# Altium schematic sheet Control Levitador.SchDoc
size A3
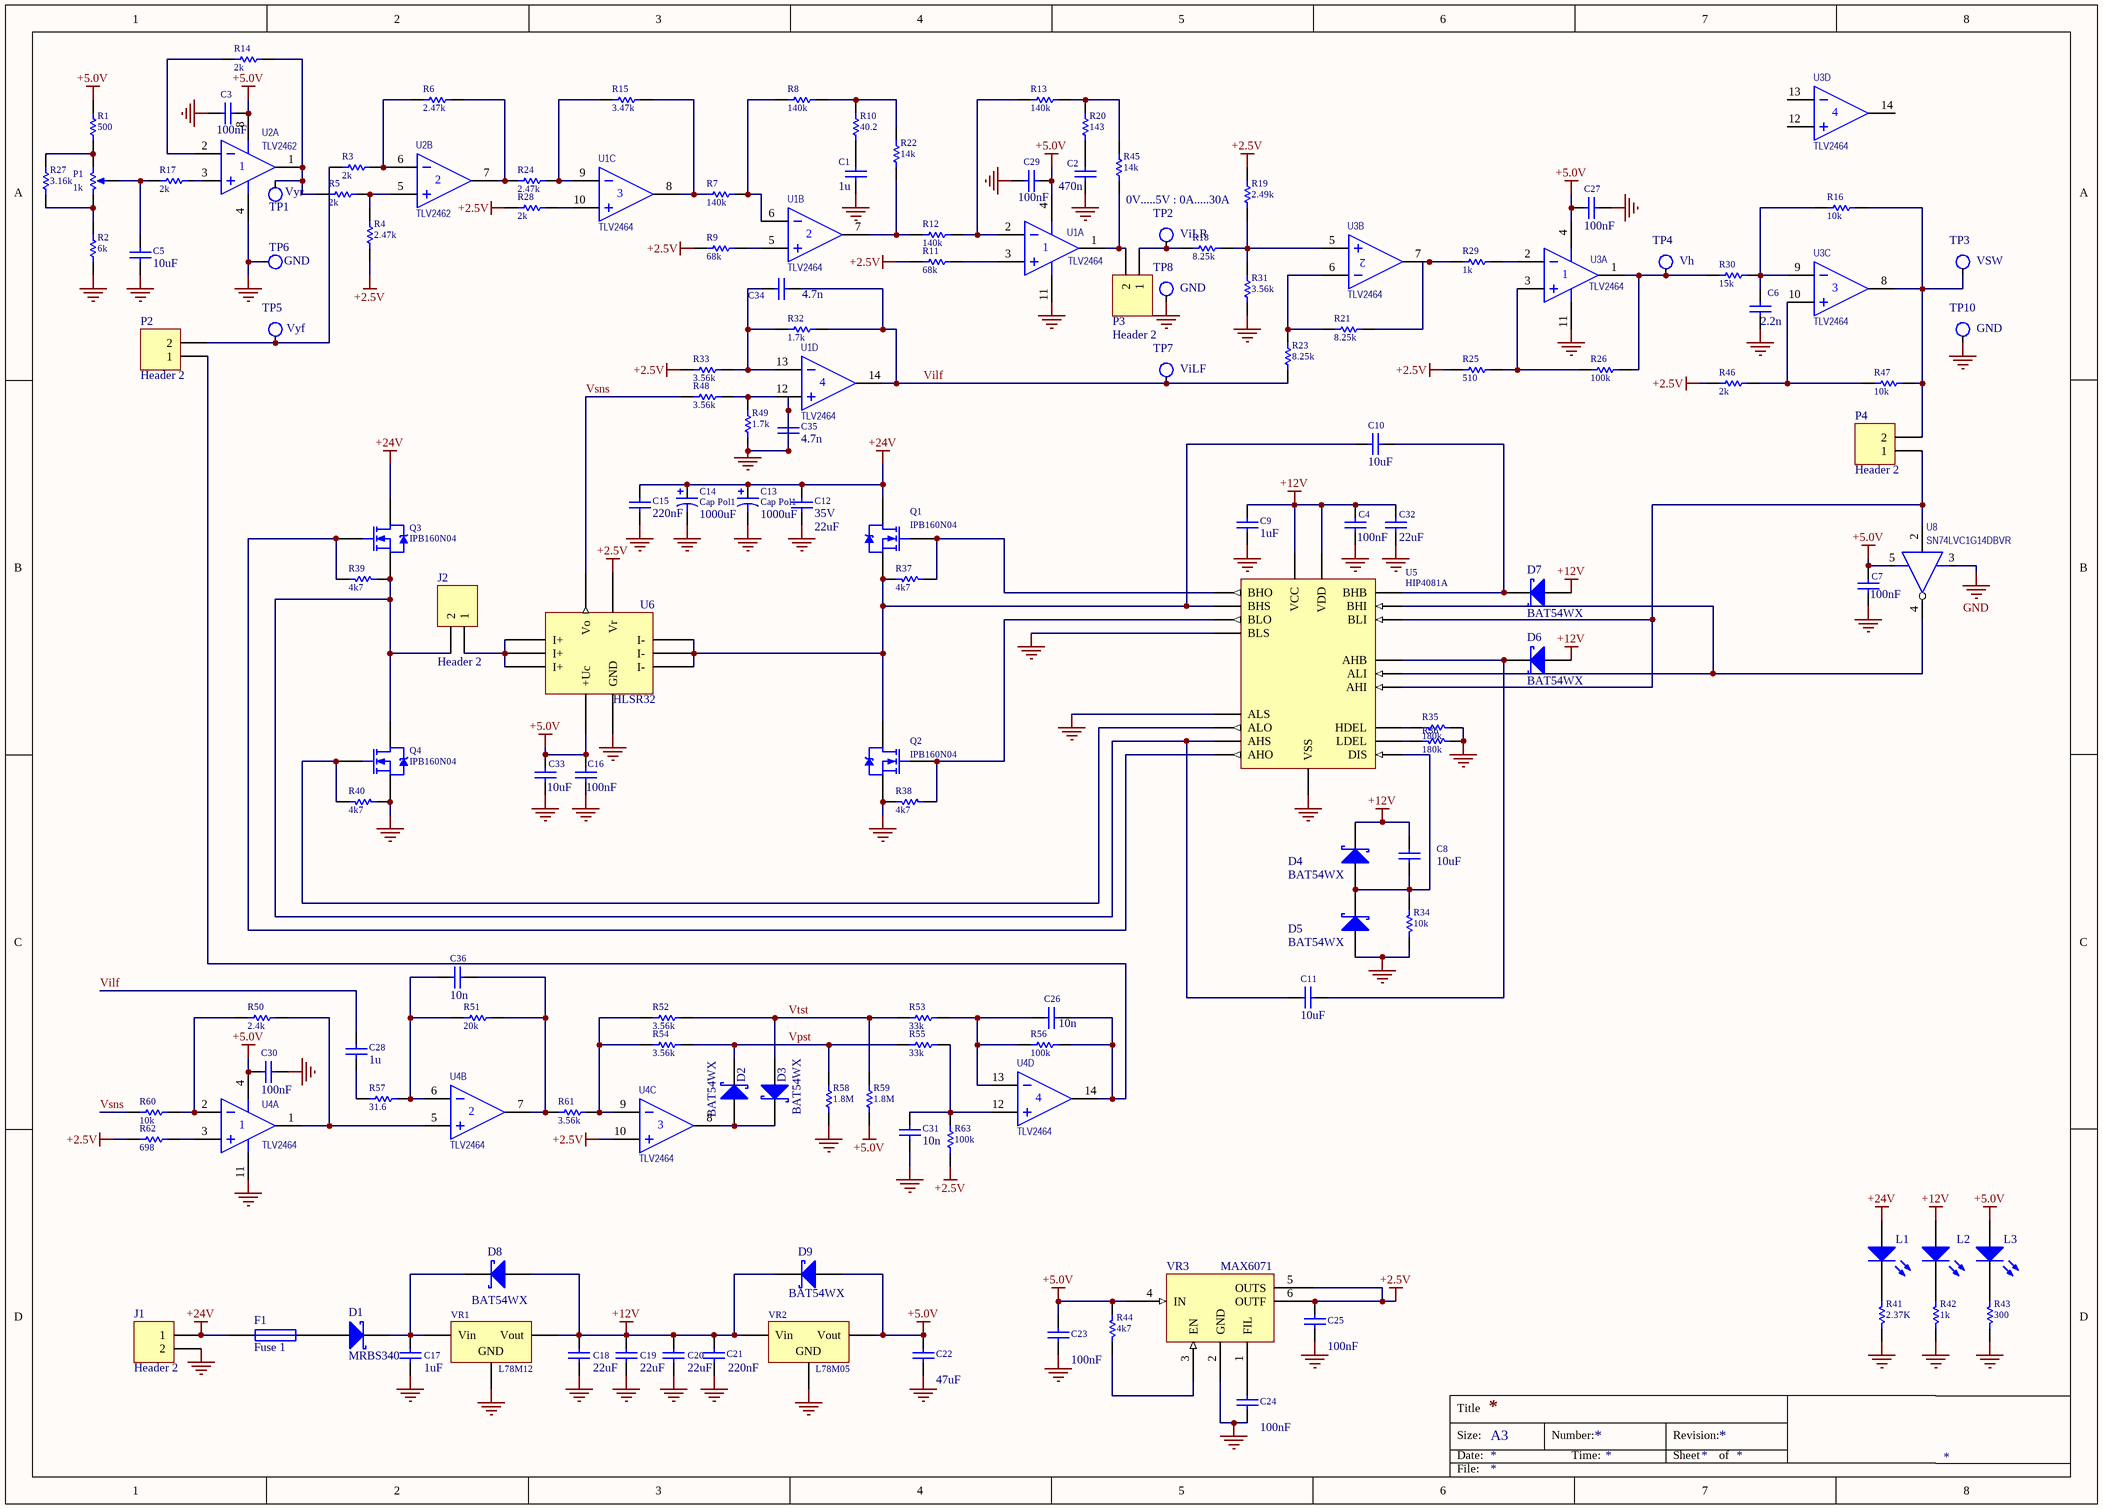
[diagram p0: Control Levitador.SchDoc]

## Parts
C1  1u  [C1206]
C2  470n  [C1206]
C3  100nF  [C1206]
C4  100nF  [C1206]
C5  10uF  [C1206]
C6  2.2n  [C1206]
C7  100nF  [C1206]
C8  10uF  [C1206]
C9  1uF  [C1206]
C10  10uF  [C1206]
C11  10uF  [C1206]
C12  Voltage: 35V  [C0805]  (hidden comment: 22uF)
C13  Cap Pol1  value 1000uF  [ALU CASE P]
C14  Cap Pol1  value 1000uF  [ALU CASE P]
C15  220nF  [C1206]
C16  100nF  [C1206]
C17  1uF  [C1206]
C18  22uF  [C1206]
C19  22uF  [C1206]
C20  22uF  [C1206]
C21  220nF  [C1206]
C22  47uF  [C1206]
C23  100nF  [C1206]
C24  100nF  [C1206]
C25  100nF  [C1206]
C26  10n  [C1206]
C27  100nF  [C1206]
C28  1u  [C1206]
C29  100nF  [C1206]
C30  100nF  [C1206]
C31  10n  [C1206]
C32  22uF  [C1206]
C33  10uF  [C1206]
C34  4.7n  [C1206]
C35  4.7n  [C1206]
C36  10n  [C1206]
D1  MRBS340  [DO214AB]
D2  BAT54WX  [SOD523]
D3  BAT54WX  [SOD523]
D4  BAT54WX  [SOD523]
D5  BAT54WX  [SOD523]
D6  BAT54WX  [SOD523]
D7  BAT54WX  [SOD523]
D8  BAT54WX  [SOD523]
D9  BAT54WX  [SOD523]
F1  Fuse 1  [R1206]
J1  Header 2  [SMKDS5-2-9.5]
J2  Header 2  [SMKDS5-2-9.5]
L1  LED1  [LED 1206 RED]  (value not drawn)
L2  LED1  [LED 1206 RED]  (value not drawn)
L3  LED1  [LED 1206 RED]  (value not drawn)
P1  value 1k  [BOR3]  (hidden comment: RPot)
P2  Header 2  [HDR1X2]
P3  Header 2  [HDR1X2]
P4  Header 2  [HDR1X2]
Q1  IPB160N04  [TO263-7S]
Q2  IPB160N04  [TO263-7S]
Q3  IPB160N04  [TO263-7S]
Q4  IPB160N04  [TO263-7S]
R1  500  [R1206]
R2  6k  [R1206]
R3  2k  [R1206]
R4  2.47k  [R1206]
R5  2k  [R1206]
R6  2.47k  [R1206]
R7  140k  [R1206]
R8  140k  [R1206]
R9  68k  [R1206]
R10  40.2  [R1206]
R11  68k  [R1206]
R12  140k  [R1206]
R13  140k  [R1206]
R14  2k  [R1206]
R15  3.47k  [R1206]
R16  10k  [R1206]
R17  2k  [R1206]
R18  8.25k  [R1206]
R19  2.49k  [R1206]
R20  143  [R1206]
R21  8.25k  [R1206]
R22  14k  [R1206]
R23  8.25k  [R1206]
R24  2.47k  [R1206]
R25  510  [R1206]
R26  100k  [R1206]
R27  3.16k  [R1206]
R28  2k  [R1206]
R29  1k  [R1206]
R30  15k  [R1206]
R31  3.56k  [R1206]
R32  1.7k  [R1206]
R33  3.56k  [R1206]
R34  10k  [R1206]
R35  180k  [R1206]
R36  180k  [R1206]
R37  4k7  [R1206]
R38  4k7  [R1206]
R39  4k7  [R1206]
R40  4k7  [R1206]
R41  2.37K  [R1206]
R42  1k  [R1206]
R43  300  [R1206]
R44  4k7  [R1206]
R45  14k  [R1206]
R46  2k  [R1206]
R47  10k  [R1206]
R48  3.56k  [R1206]
R49  1.7k  [R1206]
R50  2.4k  [R1206]
R51  20k  [R1206]
R52  3.56k  [R1206]
R53  33k  [R1206]
R54  3.56k  [R1206]
R55  33k  [R1206]
R56  100k  [R1206]
R57  31.6  [R1206]
R58  1.8M  [R1206]
R59  1.8M  [R1206]
R60  10k  [R1206]
R61  3.56k  [R1206]
R62  698  [R1206]
R63  100k  [R1206]
TP1  Vyr  [TestPoint Keystone 5000 Silver-Red]
TP2  ViLR  [TestPoint Keystone 5000 Silver-Red]
TP3  VSW  [TestPoint Keystone 5000 Silver-Red]
TP4  Vh  [TestPoint Keystone 5000 Silver-Red]
TP5  Vyf  [TestPoint Keystone 5000 Silver-Red]
TP6  GND  [TestPoint Keystone 5000 Silver-Red]
TP7  ViLF  [TestPoint Keystone 5000 Silver-Red]
TP8  GND  [TestPoint Keystone 5000 Silver-Red]
TP10  GND  [TestPoint Keystone 5000 Silver-Red]
U1  TLV2464  [SOIC14]  (parts A,B,C,D of 4)
U2  TLV2462  [SOIC8]  (parts A,B of 2)
U3  TLV2464  [SOIC14]  (parts A,B,C,D of 4)
U4  TLV2464  [SOIC14]  (parts A,B,C,D of 4)
U5  HIP4081A  [SOIC20]
U6  HLSR32  [HSLR-P]
U8  SN74LVC1G14DBVR  [SOT23-5]
VR1  L78M12  [TO252-AA]
VR2  L78M05  [TO252-AA]
VR3  MAX6071  [SOT23-6]

## Nets
+2.5V: C25.2 R4.1 R9.1 R11.2 R19.2 R25.2 R28.1 R33.1 R46.2 R62.1 R63.2 U4.10(IN+) U6.1(Vr) VR3.5(OUTS) VR3.6(OUTF)
+5.0V: C3.2 C7.2 C16.2 C22.2 C23.2 C27.2 C29.2 C30.2 C33.2 D9.1(A) L3.1(A) R1.2 R44.2 R59.1 U1.4(V+) U2.8(V+) U3.4(V+) U4.4(V+) U6.4(+Uc) U8.5(V+) VR2.3(Vout) VR3.4(IN)
+12V: C4.2 C8.1 C9.2 C18.2 C19.2 C20.2 C21.2 C32.2 D4.2(K) D6.1(A) D7.1(A) D8.1(A) D9.2(K) L2.1(A) U5.15(VCC) U5.16(VDD) VR1.3(Vout) VR2.1(Vin)
+24V: C12.2 C13.1 C14.1 C15.2 F1.1 J1.1 L1.1(A) Q1.4(D) Q3.4(D)
GND: C1.1 C2.1 C3.1 C4.1 C5.1 C6.1 C7.1 C9.1 C12.1 C13.2 C14.2 C15.1 C16.1 C17.1 C18.1 C19.1 C20.1 C21.1 C22.1 C23.1 C24.1 C25.1 C27.1 C29.1 C30.1 C31.1 C32.1 C33.1 C35.1 C35.2 D5.1(A) J1.2 Q2.2(S) Q2.3(S) Q2.5(S) Q2.6(S) Q2.7(S) Q4.2(S) Q4.3(S) Q4.5(S) Q4.6(S) Q4.7(S) R2.1 R31.1 R34.2 R35.1 R36.1 R38.2 R40.1 R41.1 R42.2 R43.1 R49.1 R58.1 TP6.1 TP8.1 TP10.1 U1.11(V-) U2.4(V-) U3.11(V-) U4.11(V-) U5.4(VSS) U5.14(ALS) U5.17(BLS) U6.3(GND) U8.3(V-) VR1.4(GND) VR2.4(GND) VR3.2(GND)
Vilf: C28.1 C34.2 R23.1 R32.2 TP7.1 U1.14(OUT)
Vpst: D2.2(K) R54.2 R55.2 R58.2
Vsns: R48.2 R60.1 U6.2(Vo)
Vtst: D3.1(A) R52.2 R53.2 R59.2
NetC1_2: C1.2 R10.1
NetC2_2: C2.2 R20.1
NetC5_2: C5.2 P1.2(TAP) R17.2
NetC6_2: C6.2 R16.1 R30.2 U3.9(IN-)
NetC8_2: C8.2 D4.1(A) D5.2(K) R34.1 U5.3(DIS)
NetC10_1: C10.1 D7.2(K) U5.1(BHB)
NetC10_2: C10.2 Q1.2(S) Q1.3(S) Q1.5(S) Q1.6(S) Q1.7(S) Q2.4(D) R37.2 U5.19(BHS) U6.5(I-) U6.6(I-) U6.7(I-)
NetC11_1: C11.1 D6.2(K) U5.10(AHB)
NetC11_2: C11.2 J2.2 Q3.2(S) Q3.3(S) Q3.5(S) Q3.6(S) Q3.7(S) Q4.4(D) R39.1 U5.12(AHS)
NetC17_2: C17.2 D1.2(K) D8.2(K) VR1.1(Vin)
NetC24_2: C24.2 VR3.1(FIL)
NetC26_1: C26.1 P2.1 R56.1 U4.14(OUT)
NetC26_2: C26.2 R53.1 R56.2 U4.13(IN-)
NetC28_2: C28.2 R57.1
NetC31_2: C31.2 R55.1 R63.1 U4.12(IN+)
NetC34_1: C34.1 R32.1 R33.2 U1.13(IN-)
NetC36_1: C36.1 R51.1 R57.2 U4.6(IN-)
NetC36_2: C36.2 R51.2 R61.1 U4.7(OUT)
NetD1_1: D1.1(A) F1.2
NetD2_1: D2.1(A) D3.2(K) U4.8(OUT)
NetJ2_1: J2.1 U6.8(I+) U6.9(I+) U6.10(I+)
NetL1_2: L1.2(K) R41.2
NetL2_2: L2.2(K) R42.1
NetL3_2: L3.2(K) R43.2
NetP1_1: P1.1(TOP) R1.1 R27.2
NetP1_3: P1.3(BOT) R2.2 R27.1
NetP2_2: P2.2 R3.2 TP5.1
NetP3_1: P3.1 R18.2 TP2.1
NetP3_2: P3.2 R45.2 U1.1(OUT)
NetP4_1: P4.1 U5.5(BLI) U5.7(AHI) U8.2(A)
NetP4_2: P4.2 R16.2 R47.1 TP3.1 U3.8(OUT)
NetQ1_1: Q1.1(G) R37.1 U5.20(BHO)
NetQ2_1: Q2.1(G) R38.1 U5.18(BLO)
NetQ3_1: Q3.1(G) R39.2 U5.11(AHO)
NetQ4_1: Q4.1(G) R40.2 U5.13(ALO)
NetR3_1: R3.1 R6.1 U2.6(IN-)
NetR4_2: R4.2 R5.2 U2.5(IN+)
NetR5_1: R5.1 R14.1 TP1.1 U2.1(OUT)
NetR6_2: R6.2 R24.1 U2.7(OUT)
NetR7_1: R7.1 R15.2 U1.8(OUT)
NetR7_2: R7.2 R8.1 U1.6(IN-)
NetR8_2: R8.2 R10.2 R22.1
NetR9_2: R9.2 U1.5(IN+)
NetR11_1: R11.1 U1.3(IN+)
NetR12_1: R12.1 R22.2 U1.7(OUT)
NetR12_2: R12.2 R13.1 U1.2(IN-)
NetR13_2: R13.2 R20.2 R45.1
NetR14_2: R14.2 U2.2(IN-)
NetR15_1: R15.1 R24.2 U1.9(IN-)
NetR17_1: R17.1 U2.3(IN+)
NetR18_1: R18.1 R19.1 R31.2 U3.5(IN+)
NetR21_1: R21.1 R23.2 U3.6(IN-)
NetR21_2: R21.2 R29.1 U3.7(OUT)
NetR25_1: R25.1 R26.2 U3.3(IN+)
NetR26_1: R26.1 R30.1 TP4.1 U3.1(OUT)
NetR28_2: R28.2 U1.10(IN+)
NetR29_2: R29.2 U3.2(IN-)
NetR35_2: R35.2 U5.8(HDEL)
NetR36_2: R36.2 U5.9(LDEL)
NetR44_1: R44.1 VR3.3(EN)
NetR46_1: R46.1 R47.2 U3.10(IN+)
NetR48_1: R48.1 R49.2 U1.12(IN+)
NetR50_1: R50.1 R60.2 U4.2(IN-)
NetR50_2: R50.2 U4.1(OUT) U4.5(IN+)
NetR52_1: R52.1 R54.1 R61.2 U4.9(IN-)
NetR62_2: R62.2 U4.3(IN+)
NetU5_2: U5.2(BHI) U5.6(ALI) U8.4(Y)

Not connected (* = marked no-connect by the designer): U3 12(IN+) 13(IN-) 14(OUT)

## Notes on the sheet
- (near R19) 0V.....5V : 0A.....30A
- Title
- Size:
- Date:
- A3
- Number:
- Time:
- Revision:
- Sheet
- of
- File:

## Library data of the parts
C1-C11 C15 C16 C23-C36 = C1206: Capacitor Chip 1206; Dielectric: NP0; Voltage: 50V; Published: 8-Jun-2000; LatestRevisionDate: 26/08/2013; LatestRevisionNote: IPC-7351 Footprint Added.; PackageReference: 1206; Publisher: Altium Limited; PackageDescription: Chip Capacitor; Supplier 1: Digi-Key
  C1 C28: Value: 1u
  C2: Value: 470n
  C3 C4 C7 C16 C23-C25 C27 C29 C30: Value: 100nF
  C5 C8 C10 C11 C33: Value: 10uF
  C6: Value: 2.2n
  C9: Value: 1uF
  C15: Value: 220nF
  C26 C31 C36: Value: 10n
  C32: Value: 22uF
  C34 C35: Value: 4.7n
C12 = C1206: Capacitor Chip 1206; Dielectric: NP0; Published: 8-Jun-2000; LatestRevisionDate: 26/08/2013; LatestRevisionNote: IPC-7351 Footprint Added.; PackageReference: 1206; Publisher: Altium Limited; PackageDescription: Chip Capacitor; Supplier 1: Digi-Key; Value: 22uF
C13 C14 = Cap Pol1: Polarized Capacitor (Radial); Published: 8-Jun-2000; LatestRevisionDate: 17-Jul-2002; LatestRevisionNote: Re-released for DXP Platform.; PackageReference: RB7.6-15; Publisher: Altium Limited
C17 C21 = C1206: Capacitor Chip 1206; Dielectric: NP0; Voltage: 35V; Published: 8-Jun-2000; LatestRevisionDate: 26/08/2013; LatestRevisionNote: IPC-7351 Footprint Added.; PackageReference: 1206; Publisher: Altium Limited; PackageDescription: Chip Capacitor; Supplier 1: Digi-Key
  C17: Value: 1uF
  C21: Value: 220nF
C18-C20 = C1206: Capacitor Chip 1206; Dielectric: NP0; Voltage: 16V; Published: 8-Jun-2000; LatestRevisionDate: 26/08/2013; LatestRevisionNote: IPC-7351 Footprint Added.; PackageReference: 1206; Publisher: Altium Limited; PackageDescription: Chip Capacitor; Supplier 1: Digi-Key; Value: 22uF
C22 = C1206: Capacitor Chip 1206; Dielectric: NP0; Voltage: 6.3V; Published: 8-Jun-2000; LatestRevisionDate: 26/08/2013; LatestRevisionNote: IPC-7351 Footprint Added.; PackageReference: 1206; Publisher: Altium Limited; PackageDescription: Chip Capacitor; Supplier 1: Digi-Key; Value: 47uF
D1-D9 = Diode 10TQ035: Schottky Rectifier; Note: Terminal 2 is the TAB and is electrically connected to the cathode; Published: 8-Jun-2000; LatestRevisionDate: 17-Jul-2002; LatestRevisionNote: Re-released for DXP Platform.; DatasheetDocument: PD-2.057B; PackageDocument: Feb-1998; PackageReference: TO-220AC; Publisher: Altium Limited; ComponentLink1Description: Manufacturer Link; ComponentLink1URL: http://www.irf.com/; ComponentLink2Description: Datasheet; ComponentLink2URL: http://www.irf.com/product-info/datasheets/data/10tq.pdf
F1 = Fuse 1: Fuse; Published: 8-Jun-2000; LatestRevisionDate: 17-Jul-2002; LatestRevisionNote: Re-released for DXP Platform.; PackageReference: PIN-W2/E2.8; Publisher: Altium Limited
J1 J2 P2-P4 = Header 2: Header, 2-Pin; LatestRevisionDate: 17-Jul-2002; LatestRevisionNote: Re-released for DXP Platform.; Publisher: Altium Limited
L1-L3 = LED1: Typical RED GaAs LED; Published: 8-Jun-2000; LatestRevisionDate: 08-Jul-2005; LatestRevisionNote: Mech Layer 1 removed.; PackageReference: LED-1; Publisher: Altium Limited
P1 = RPot: Potentiometer; Sim Note: Enter the Resistance value and the set point into parameter fields.; Set Position: 0.5; Published: 8-Jun-2000; LatestRevisionDate: 17-Jul-2002; LatestRevisionNote: Re-released for DXP Platform.; PackageReference: VR5; Publisher: Altium Limited
Q1-Q4 = IRF630S: HEXFET N-Channel Power MOSFET; Published: 8-Jun-2000; LatestRevisionDate: 17-Jul-2002; LatestRevisionNote: Re-released for DXP Platform.; DatasheetVersion: PD-9.901; PackageReference: PG-TO263-7-3; Publisher: Altium Limited; PackageDescription: D2-PAK/TO-263-AB; 3 Leads (1 Cropped); Body 15.5 (inc. leads) x 10.5 mm (LxW max); ComponentLink1Description: Manufacturer Link; ComponentLink1URL: http://www.irf.com/; ComponentLink2Description: Datasheet; ComponentLink2URL: http://www.irf.com/product-info/datasheets/data/irf630s.pdf
R1-R63 = R1206: Resistor Chip; 1/8W;; Manufacturer: Panasonic; Tolerance: 1%; LatestRevisionDate: 29/7/2021; PackageReference: 1206; PackageDescription: SMT Chip Resistor; Supplier 1: Digi-Key
  R1: Value: 500
  R2: Value: 6k
  R3 R5 R14 R17 R28 R46: Value: 2k
  R4 R6 R24: Value: 2.47k
  R7 R8 R12 R13: Value: 140k
  R9 R11: Value: 68k
  R10: Value: 40.2
  R15: Value: 3.47k
  R16 R34 R47 R60: Value: 10k
  R18 R21 R23: Value: 8.25k
  R19: Value: 2.49k
  R20: Value: 143
  R22 R45: Value: 14k
  R25: Value: 510
  R26 R56 R63: Value: 100k
  R27: Value: 3.16k
  R29 R42: Value: 1k
  R30: Value: 15k
  R31 R33 R48 R52 R54 R61: Value: 3.56k
  R32 R49: Value: 1.7k
  R35 R36: Value: 180k
  R37-R40 R44: Value: 4k7
  R41: Value: 2.37K
  R43: Value: 300
  R50: Value: 2.4k
  R51: Value: 20k
  R53 R55: Value: 33k
  R57: Value: 31.6
  R58 R59: Value: 1.8M
  R62: Value: 698
TP1-TP8 TP10 = Tespoint: Test point
U1 U3 U4 = TLV2464: Dual Low-Power Operational Amplifier; Published: 15-Apr-2002; LatestRevisionDate: 13-Apr-2006; LatestRevisionNote: IPC-7351 Footprint Added.; DatasheetVersion: Jul-1988; PackageVersion: Jan-1998; PackageReference: D008; Publisher: Altium Limited; PackageDescription: 8-Pin Small Outline Integrated Circuit 1.27 mm Pitch; Code_IPC: SOIC127P600-8; ComponentLink1Description: Manufacturer Link; ComponentLink1URL: http://www.ti.com/; ComponentLink2Description: Datasheet; ComponentLink2URL: http://www-s.ti.com/sc/ds/tl022.pdf
U2 = TLV2462: Dual Low-Power Operational Amplifier; Published: 15-Apr-2002; LatestRevisionDate: 13-Apr-2006; LatestRevisionNote: IPC-7351 Footprint Added.; DatasheetVersion: Jul-1988; PackageVersion: Jan-1998; PackageReference: D008; Publisher: Altium Limited; PackageDescription: 8-Pin Small Outline Integrated Circuit 1.27 mm Pitch; Code_IPC: SOIC127P600-8; ComponentLink1Description: Manufacturer Link; ComponentLink1URL: http://www.ti.com/; ComponentLink2Description: Datasheet; ComponentLink2URL: http://www-s.ti.com/sc/ds/tl022.pdf
U5 = HIP4081A: INTERSIL, 80V, 2.5A peak, High Frequency Full Bridge FET Driver; Manufacturer_Part_Number: HIP4081AIBZ; Datasheet: https://www.mouser.jp/datasheet/2/698/hip4081a-1528771.pdf
U6 = HSLR32: Hall Effect Current Sensor
U8 = SN74LVC1G14DBVR: Schmitt-Trigger Inverter; Published: 8-Jun-2000; LatestRevisionDate: 13-Apr-2006; LatestRevisionNote: IPC-7351 Footprint Added.; DatasheetVersion: Jul-1998; PackageVersion: Jan-1998; PackageReference: D014; Publisher: Altium Limited; PackageDescription: 14-Pin Small Outline Integrated Circuit 1.27 mm Pitch; Code_IPC: SOIC127P600-14; ComponentLink1Description: Manufacturer Link; ComponentLink1URL: http://www.ti.com/; ComponentLink2Description: Datasheet; ComponentLink2URL: http://www-s.ti.com/sc/ds/sn74ahc14.pdf; ComponentLink3Description: Packaging Specification; ComponentLink3URL: http://focus.ti.com/lit/ml/mpds177/mpds177.pdf
VR1 VR2 = Volt Reg: Voltage Regulator; Published: 24-Mar-1999; LatestRevisionDate: 17-Jul-2002; LatestRevisionNote: Re-released for DXP Platform.; PackageReference: D2PAK; Publisher: Altium Limited; Code_JEDEC: SMD-220
  VR2: Datasheet: https://ar.mouser.com/datasheet/2/389/cd00000447-1795461.pdf; Mouser: https://ar.mouser.com/ProductDetail/STMicroelectronics/L78M05CDT-TR?qs=JIXmGdi%252BcuKa7ml6d%2FqNIw%3D%3D
VR3 = MAX6070: Mouser: https://ar.mouser.com/ProductDetail/Maxim-Integrated/MAX6071AAUT25%2bT?qs=CEvMt6SrWlKJTy86qST01Q%3D%3D; Datasheet: https://ar.mouser.com/datasheet/2/256/MAX6070_MAX6071-217862.pdf